# Altium schematic sheet mojo_cnc_shield.schdoc
size 491 x 209 mm
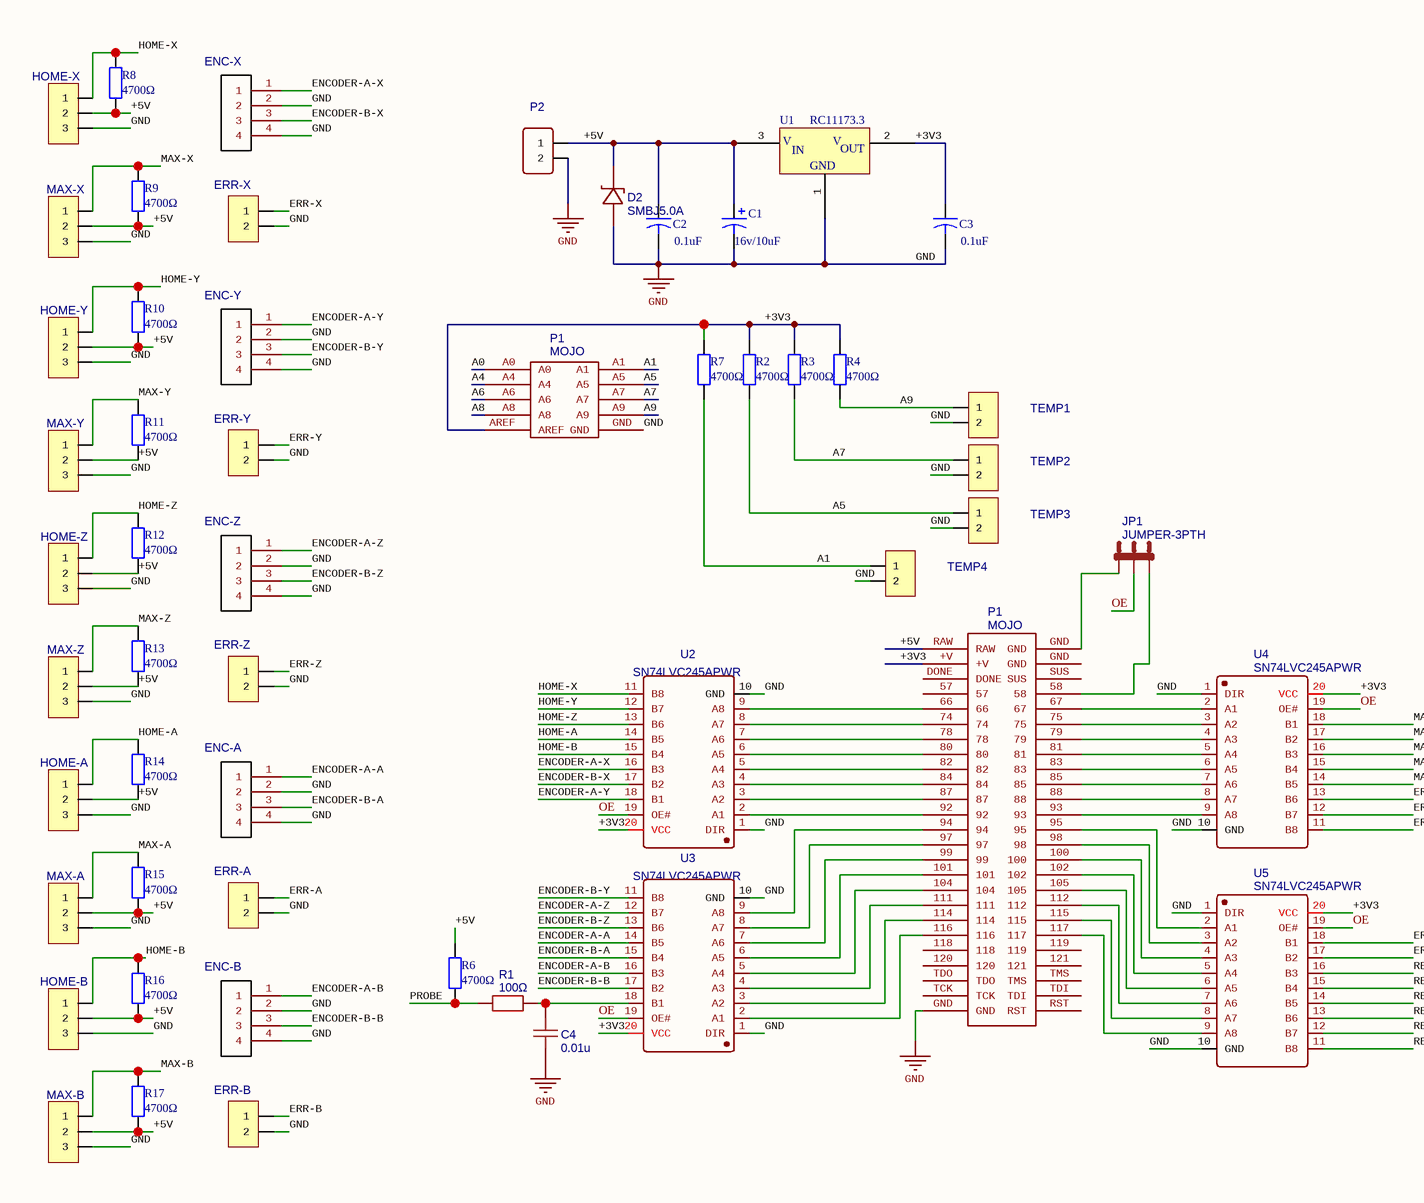
[diagram p0: mojo_cnc_shield.schdoc, left]
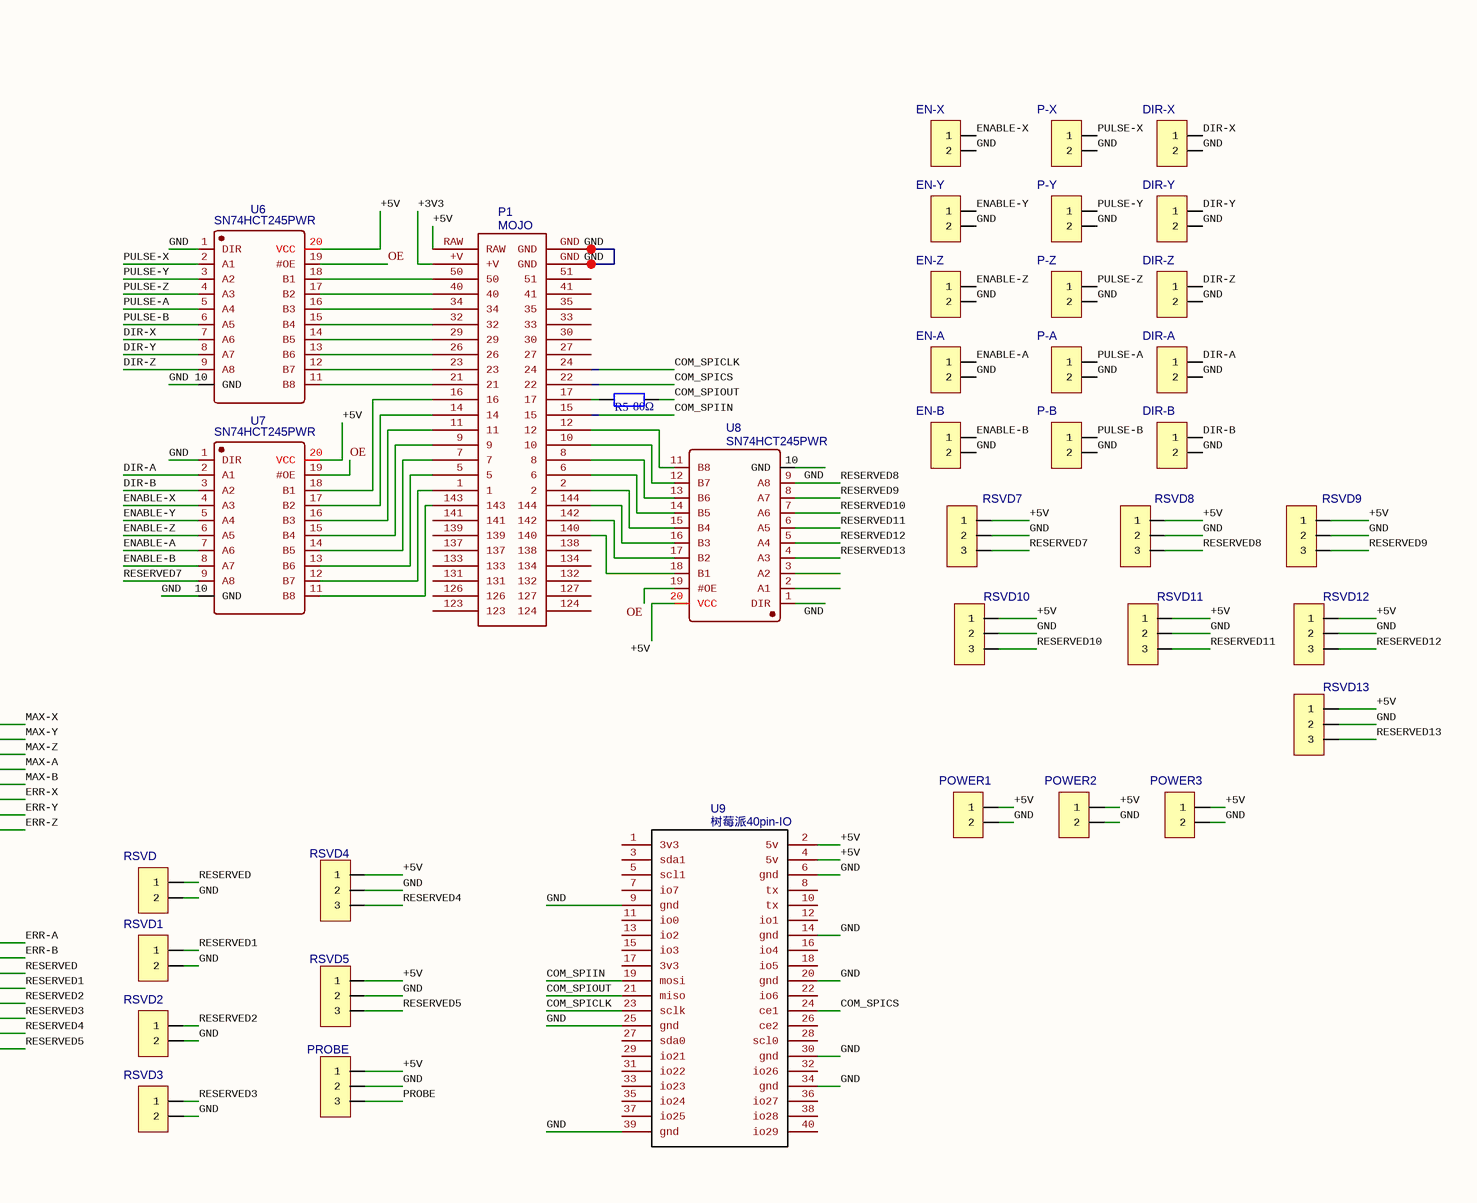
[diagram p1: mojo_cnc_shield.schdoc, right]

## Parts
(Parts that share a designator on the sheet are numbered #1, #2 ... from top to bottom, then left to right.)
C1  16v/10uF  [C1206]
C2  0.1uF  [C0805]
C3  0.1uF  [C0805]
C4  0.01u  [C0805]
D2  SMBJ5.0A  [SMB_L4.6-W3.6-LS5.3-R-RD]
DIR-A  5264-2P  [HDR-M-2.54_1X2]  (value not drawn)
DIR-B  5264-2P  [HDR-M-2.54_1X2]  (value not drawn)
DIR-X  5264-2P  [HDR-M-2.54_1X2]  (value not drawn)
DIR-Y  5264-2P  [HDR-M-2.54_1X2]  (value not drawn)
DIR-Z  5264-2P  [HDR-M-2.54_1X2]  (value not drawn)
EN-A  5264-2P  [HDR-M-2.54_1X2]  (value not drawn)
EN-B  5264-2P  [HDR-M-2.54_1X2]  (value not drawn)
EN-X  5264-2P  [HDR-M-2.54_1X2]  (value not drawn)
EN-Y  5264-2P  [HDR-M-2.54_1X2]  (value not drawn)
EN-Z  5264-2P  [HDR-M-2.54_1X2]  (value not drawn)
ENC-A  5264-04A  [HDR-M-2.54_1X4]  (value not drawn)
ENC-B  5264-04A  [HDR-M-2.54_1X4]  (value not drawn)
ENC-X  5264-04A  [HDR-M-2.54_1X4]  (value not drawn)
ENC-Y  5264-04A  [HDR-M-2.54_1X4]  (value not drawn)
ENC-Z  5264-04A  [HDR-M-2.54_1X4]  (value not drawn)
ERR-A  5264-2P  [HDR-M-2.54_1X2]  (value not drawn)
ERR-B  5264-2P  [HDR-M-2.54_1X2]  (value not drawn)
ERR-X  5264-2P  [HDR-M-2.54_1X2]  (value not drawn)
ERR-Y  5264-2P  [HDR-M-2.54_1X2]  (value not drawn)
ERR-Z  5264-2P  [HDR-M-2.54_1X2]  (value not drawn)
HOME-A  5264-3P  [HDR-M-2.54_1X3]  (value not drawn)
HOME-B  5264-3P  [HDR-M-2.54_1X3]  (value not drawn)
HOME-X  5264-3P  [HDR-M-2.54_1X3]  (value not drawn)
HOME-Y  5264-3P  [HDR-M-2.54_1X3]  (value not drawn)
HOME-Z  5264-3P  [HDR-M-2.54_1X3]  (value not drawn)
JP1  JUMPER-3PTH  [1X03]
MAX-A  5264-3P  [HDR-M-2.54_1X3]  (value not drawn)
MAX-B  5264-3P  [HDR-M-2.54_1X3]  (value not drawn)
MAX-X  5264-3P  [HDR-M-2.54_1X3]  (value not drawn)
MAX-Y  5264-3P  [HDR-M-2.54_1X3]  (value not drawn)
MAX-Z  5264-3P  [HDR-M-2.54_1X3]  (value not drawn)
P1#1  MOJO  [MOJO]
P1#2  MOJO  [MOJO]
P1#3  MOJO  [MOJO]
P2  CONN-TH_2P-P5.08  [CONN-TH_2P-P5.08]  (value not drawn)
P-A  5264-2P  [HDR-M-2.54_1X2]  (value not drawn)
P-B  5264-2P  [HDR-M-2.54_1X2]  (value not drawn)
P-X  5264-2P  [HDR-M-2.54_1X2]  (value not drawn)
P-Y  5264-2P  [HDR-M-2.54_1X2]  (value not drawn)
P-Z  5264-2P  [HDR-M-2.54_1X2]  (value not drawn)
POWER1  5264-2P  [HDR-M-2.54_1X2]  (value not drawn)
POWER2  5264-2P  [HDR-M-2.54_1X2]  (value not drawn)
POWER3  5264-2P  [HDR-M-2.54_1X2]  (value not drawn)
PROBE  5264-3P  [HDR-M-2.54_1X3]  (value not drawn)
R1  100Ω  [R0805]
R2  4700Ω  [R0805]
R3  4700Ω  [R0805]
R4  4700Ω  [R0805]
R5  80Ω  [R0805]
R6  4700Ω  [R0805]
R7  4700Ω  [R0805]
R8  4700Ω  [R0805]
R9  4700Ω  [R0805]
R10  4700Ω  [R0805]
R11  4700Ω  [R0805]
R12  4700Ω  [R0805]
R13  4700Ω  [R0805]
R14  4700Ω  [R0805]
R15  4700Ω  [R0805]
R16  4700Ω  [R0805]
R17  4700Ω  [R0805]
RSVD  5264-2P  [HDR-M-2.54_1X2]  (value not drawn)
RSVD1  5264-2P  [HDR-M-2.54_1X2]  (value not drawn)
RSVD2  5264-2P  [HDR-M-2.54_1X2]  (value not drawn)
RSVD3  5264-2P  [HDR-M-2.54_1X2]  (value not drawn)
RSVD4  5264-3P  [HDR-M-2.54_1X3]  (value not drawn)
RSVD5  5264-3P  [HDR-M-2.54_1X3]  (value not drawn)
RSVD7  5264-3P  [HDR-M-2.54_1X3]  (value not drawn)
RSVD8  5264-3P  [HDR-M-2.54_1X3]  (value not drawn)
RSVD9  5264-3P  [HDR-M-2.54_1X3]  (value not drawn)
RSVD10  5264-3P  [HDR-M-2.54_1X3]  (value not drawn)
RSVD11  5264-3P  [HDR-M-2.54_1X3]  (value not drawn)
RSVD12  5264-3P  [HDR-M-2.54_1X3]  (value not drawn)
RSVD13  5264-3P  [HDR-M-2.54_1X3]  (value not drawn)
TEMP1  5264-2P  [HDR-M-2.54_1X2]  (value not drawn)
TEMP2  5264-2P  [HDR-M-2.54_1X2]  (value not drawn)
TEMP3  5264-2P  [HDR-M-2.54_1X2]  (value not drawn)
TEMP4  5264-2P  [HDR-M-2.54_1X2]  (value not drawn)
U1  RC11173.3  [SOT-223]
U2  SN74LVC245APWR  [TSSOP-20_L6.5-W4.4-P0.65-LS6.4-BL]
U3  SN74LVC245APWR  [TSSOP-20_L6.5-W4.4-P0.65-LS6.4-BL]
U4  SN74LVC245APWR  [TSSOP-20_L6.5-W4.4-P0.65-LS6.4-BL]
U5  SN74LVC245APWR  [TSSOP-20_L6.5-W4.4-P0.65-LS6.4-BL]
U6  SN74HCT245PWR  [TSSOP-20_L6.5-W4.4-P0.65-LS6.4-BL]
U7  SN74HCT245PWR  [TSSOP-20_L6.5-W4.4-P0.65-LS6.4-BL]
U8  SN74HCT245PWR  [TSSOP-20_L6.5-W4.4-P0.65-LS6.4-BL]
U9  树莓派40pin-IO  [树莓派40PIN-IO]

## Nets
GND: C1.2 C2.2 C3.2 C4.2 D2.1(A) DIR-A.2 DIR-B.2 DIR-X.2 DIR-Y.2 DIR-Z.2 EN-A.2 EN-B.2 EN-X.2 EN-Y.2 EN-Z.2 ENC-A.2 ENC-A.4 ENC-B.2 ENC-B.4 ENC-X.2 ENC-X.4 ENC-Y.2 ENC-Y.4 ENC-Z.2 ENC-Z.4 ERR-A.2 ERR-B.2 ERR-X.2 ERR-Y.2 ERR-Z.2 HOME-A.3 HOME-B.3 HOME-X.3 HOME-Y.3 HOME-Z.3 MAX-A.3 MAX-B.3 MAX-X.3 MAX-Y.3 MAX-Z.3 P1#1.GND P1#2.GND P1#3.GND P2.2 P-A.2 P-B.2 P-X.2 P-Y.2 P-Z.2 POWER1.2 POWER2.2 POWER3.2 PROBE.2 RSVD.2 RSVD1.2 RSVD2.2 RSVD3.2 RSVD4.2 RSVD5.2 RSVD7.2 RSVD8.2 RSVD9.2 RSVD10.2 RSVD11.2 RSVD12.2 RSVD13.2 TEMP1.2 TEMP2.2 TEMP3.2 TEMP4.2 U1.1 U2.1(DIR) U2.10(GND) U3.1(DIR) U3.10(GND) U4.1(DIR) U4.10(GND) U5.1(DIR) U5.10(GND) U6.1(DIR) U6.10(GND) U7.1(DIR) U7.10(GND) U8.1(DIR) U8.10(GND) U9.6(gnd) U9.9(gnd) U9.14(gnd) U9.20(gnd) U9.25(gnd) U9.30(gnd) U9.34(gnd) U9.39(gnd)
+3V3: C3.1 P1#1.AREF P1#2.+V P1#3.+V R2.2 R3.2 R4.2 R7.2 U1.2 U2.20(VCC) U3.20(VCC) U4.20(VCC) U5.20(VCC)
+5V: C1.1 C2.1 D2.2(K) HOME-A.2 HOME-B.2 HOME-X.2 HOME-Y.2 HOME-Z.2 MAX-A.2 MAX-B.2 MAX-X.2 MAX-Y.2 MAX-Z.2 P1#2.RAW P1#3.RAW P2.1 POWER1.1 POWER2.1 POWER3.1 PROBE.1 R6.2 R8.1 R9.1 R10.1 R11.1 R12.1 R13.1 R14.1 R15.1 R16.1 R17.1 RSVD4.1 RSVD5.1 RSVD7.1 RSVD8.1 RSVD9.1 RSVD10.1 RSVD11.1 RSVD12.1 RSVD13.1 U1.3 U6.20(VCC) U7.20(VCC) U8.20(VCC) U9.2(5v) U9.4(5v)
A0: P1#1.A0
A1: P1#1.A1 R7.1 TEMP4.1
A4: P1#1.A4
A5: P1#1.A5 R2.1 TEMP3.1
A6: P1#1.A6
A7: P1#1.A7 R3.1 TEMP2.1
A8: P1#1.A8
A9: P1#1.A9 R4.1 TEMP1.1
COM_SPICLK: P1#2.24 U9.23(sclk)
COM_SPICS: P1#2.22 U9.24(ce1)
COM_SPIIN: P1#2.15 U9.19(mosi)
COM_SPIOUT: R5.2 U9.21(miso)
DIR-A: DIR-A.1 U7.2(A1)
DIR-B: DIR-B.1 U7.3(A2)
DIR-X: DIR-X.1 U6.7(A6)
DIR-Y: DIR-Y.1 U6.8(A7)
DIR-Z: DIR-Z.1 U6.9(A8)
ENABLE-A: EN-A.1 U7.7(A6)
ENABLE-B: EN-B.1 U7.8(A7)
ENABLE-X: EN-X.1 U7.4(A3)
ENABLE-Y: EN-Y.1 U7.5(A4)
ENABLE-Z: EN-Z.1 U7.6(A5)
ENCODER-A-A: ENC-A.1 U3.14(B5)
ENCODER-A-B: ENC-B.1 U3.16(B3)
ENCODER-A-X: ENC-X.1 U2.16(B3)
ENCODER-A-Y: ENC-Y.1 U2.18(B1)
ENCODER-A-Z: ENC-Z.1 U3.12(B7)
ENCODER-B-A: ENC-A.3 U3.15(B4)
ENCODER-B-B: ENC-B.3 U3.17(B2)
ENCODER-B-X: ENC-X.3 U2.17(B2)
ENCODER-B-Y: ENC-Y.3 U3.11(B8)
ENCODER-B-Z: ENC-Z.3 U3.13(B6)
ERR-A: ERR-A.1 U5.18(B1)
ERR-B: ERR-B.1 U5.17(B2)
ERR-X: ERR-X.1 U4.13(B6)
ERR-Y: ERR-Y.1 U4.12(B7)
ERR-Z: ERR-Z.1 U4.11(B8)
HOME-A: HOME-A.1 R14.2 U2.14(B5)
HOME-B: HOME-B.1 R16.2 U2.15(B4)
HOME-X: HOME-X.1 R8.2 U2.11(B8)
HOME-Y: HOME-Y.1 R10.2 U2.12(B7)
HOME-Z: HOME-Z.1 R12.2 U2.13(B6)
MAX-A: MAX-A.1 R15.2 U4.15(B4)
MAX-B: MAX-B.1 R17.2 U4.14(B5)
MAX-X: MAX-X.1 R9.2 U4.18(B1)
MAX-Y: MAX-Y.1 R11.2 U4.17(B2)
MAX-Z: MAX-Z.1 R13.2 U4.16(B3)
OE: JP1.2 U2.19(OE#) U3.19(OE#) U4.19(OE#) U5.19(OE#) U6.19(#OE) U7.19(#OE) U8.19(#OE)
PROBE: PROBE.3 R1.1 R6.1
PULSE-A: P-A.1 U6.5(A4)
PULSE-B: P-B.1 U6.6(A5)
PULSE-X: P-X.1 U6.2(A1)
PULSE-Y: P-Y.1 U6.3(A2)
PULSE-Z: P-Z.1 U6.4(A3)
RESERVED: RSVD.1 U5.16(B3)
RESERVED1: RSVD1.1 U5.15(B4)
RESERVED2: RSVD2.1 U5.14(B5)
RESERVED3: RSVD3.1 U5.13(B6)
RESERVED4: RSVD4.3 U5.12(B7)
RESERVED5: RSVD5.3 U5.11(B8)
RESERVED7: RSVD7.3 U7.9(A8)
RESERVED8: RSVD8.3 U8.9(A8)
RESERVED9: RSVD9.3 U8.8(A7)
RESERVED10: RSVD10.3 U8.7(A6)
RESERVED11: RSVD11.3 U8.6(A5)
RESERVED12: RSVD12.3 U8.5(A4)
RESERVED13: RSVD13.3 U8.4(A3)
NetC4_1: C4.1 R1.2 U3.18(B1)
NetJP1_1: JP1.1 P1#3.GND
NetJP1_3: JP1.3 P1#3.58
NetP1#2_1: P1#2.1 U7.12(B7)
NetP1#2_2: P1#2.2 U8.15(B4)
NetP1#2_5: P1#2.5 U7.13(B6)
NetP1#2_6: P1#2.6 U8.14(B5)
NetP1#2_7: P1#2.7 U7.14(B5)
NetP1#2_8: P1#2.8 U8.13(B6)
NetP1#2_9: P1#2.9 U7.15(B4)
NetP1#2_10: P1#2.10 U8.12(B7)
NetP1#2_11: P1#2.11 U7.16(B3)
NetP1#2_12: P1#2.12 U8.11(B8)
NetP1#2_14: P1#2.14 U7.17(B2)
NetP1#2_16: P1#2.16 U7.18(B1)
NetP1#2_17: P1#2.17 R5.1
NetP1#2_21: P1#2.21 U6.11(B8)
NetP1#2_23: P1#2.23 U6.12(B7)
NetP1#2_26: P1#2.26 U6.13(B6)
NetP1#2_29: P1#2.29 U6.14(B5)
NetP1#2_32: P1#2.32 U6.15(B4)
NetP1#2_34: P1#2.34 U6.16(B3)
NetP1#2_40: P1#2.40 U6.17(B2)
NetP1#2_50: P1#2.50 U6.18(B1)
NetP1#2_140: P1#2.140 U8.18(B1)
NetP1#2_142: P1#2.142 U8.17(B2)
NetP1#2_143: P1#2.143 U7.11(B8)
NetP1#2_144: P1#2.144 U8.16(B3)
NetP1#3_66: P1#3.66 U2.9(A8)
NetP1#3_67: P1#3.67 U4.2(A1)
NetP1#3_74: P1#3.74 U2.8(A7)
NetP1#3_75: P1#3.75 U4.3(A2)
NetP1#3_78: P1#3.78 U2.7(A6)
NetP1#3_79: P1#3.79 U4.4(A3)
NetP1#3_80: P1#3.80 U2.6(A5)
NetP1#3_81: P1#3.81 U4.5(A4)
NetP1#3_82: P1#3.82 U2.5(A4)
NetP1#3_83: P1#3.83 U4.6(A5)
NetP1#3_84: P1#3.84 U2.4(A3)
NetP1#3_85: P1#3.85 U4.7(A6)
NetP1#3_87: P1#3.87 U2.3(A2)
NetP1#3_88: P1#3.88 U4.8(A7)
NetP1#3_92: P1#3.92 U2.2(A1)
NetP1#3_93: P1#3.93 U4.9(A8)
NetP1#3_94: P1#3.94 U3.9(A8)
NetP1#3_95: P1#3.95 U5.2(A1)
NetP1#3_97: P1#3.97 U3.8(A7)
NetP1#3_98: P1#3.98 U5.3(A2)
NetP1#3_99: P1#3.99 U3.7(A6)
NetP1#3_100: P1#3.100 U5.4(A3)
NetP1#3_101: P1#3.101 U3.6(A5)
NetP1#3_102: P1#3.102 U5.5(A4)
NetP1#3_104: P1#3.104 U3.5(A4)
NetP1#3_105: P1#3.105 U5.6(A5)
NetP1#3_111: P1#3.111 U3.4(A3)
NetP1#3_112: P1#3.112 U5.7(A6)
NetP1#3_114: P1#3.114 U3.3(A2)
NetP1#3_115: P1#3.115 U5.8(A7)
NetP1#3_116: P1#3.116 U3.2(A1)
NetP1#3_117: P1#3.117 U5.9(A8)

Not connected (* = marked no-connect by the designer): P1#2 27 30 33 35 41 51 123 124 126 127 131 132 133 134 137 138 139 141; P1#3 57 118 119 120 121 DONE RST SUS TCK TDI TDO TMS; U8 2(A1) 3(A2); U9 1(3v3) 3(sda1) 5(scl1) 7(io7) 8(tx) 10(tx) 11(io0) 12(io1) 13(io2) 15(io3) 16(io4) 17(3v3) 18(io5) 22(io6) 26(ce2) 27(sda0) 28(scl0) 29(io21) 31(io22) 32(io26) 33(io23) 35(io24) 36(io27) 37(io25) 38(io28) 40(io29)

## Notes on the sheet
- (in symbol RC11173.3) V; IN; OUT; GND

## Library data of the parts
C4 = 0.01u: nameAlias: Value(F); Contributor: LCEDA_Lib; spicePre: C; spiceSymbolName: C_0805_US
D2 = SMBJ5.0A: BOM_Manufacturer: Brightking; BOM_Paste Type: expand; BOM_Assembly Type: smtWeld; BOM_Supplier: LCSC; BOM_Manufacturer Part: SMBJ5.0A; image: //image.lceda.cn/szlcsc/C78423.jpg; BOM_Supplier Part: C78423; spicePre: D; spiceSymbolName: SMBJ5.0A
DIR-A DIR-B DIR-X DIR-Y DIR-Z EN-A EN-B EN-X EN-Y EN-Z ERR-A ERR-B ERR-X ERR-Y ERR-Z P-A P-B P-X P-Y P-Z POWER1-POWER3 RSVD RSVD1-RSVD3 TEMP1-TEMP4 = 5264-2P: Contributor: Cherry_King; spicePre: J; spiceSymbolName: 5264-2P
ENC-A ENC-B ENC-X ENC-Y ENC-Z = 5264-04A: BOM_Manufacturer: BOOMELE; BOM_Supplier: LCSC; BOM_Manufacturer Part: 5264-04A; image: //image.lceda.cn/szlcsc/C40159.jpg; BOM_Supplier Part: C40159; spicePre: P; spiceSymbolName: 5264-04A
HOME-A HOME-B HOME-X HOME-Y HOME-Z MAX-A MAX-B MAX-X MAX-Y MAX-Z PROBE RSVD4 RSVD5 RSVD7-RSVD13 = 5264-3P: Contributor: Cherry_King; spicePre: J; spiceSymbolName: 5264-3P
JP1 = JUMPER-3PTH: Contributor: SparkFun; spicePre: J; spiceSymbolName: JUMPER-3PTH
P1#1-P1#3 = MOJO: subpart_no: 2; Contributor: feversky; spicePre: P; spiceSymbolName: MOJO
P2 = CONN-TH_2P-P5.08: Contributor: LCEDA_Lib; BOM_Supplier: LCSC; spicePre: P; spiceSymbolName: CONN-TH_2P-P5.08
R1 = 100Ω: nameAlias: Value(Ω); Contributor: LCEDA_Lib; spicePre: R; spiceSymbolName: R_0805_EU
U2-U5 = SN74LVC245APWR: BOM_Manufacturer: TI; SMT Type: Extend; spicePre: X; BOM_Supplier: LCSC; BOM_Manufacturer Part: SN74LVC245APWR; image: //image.lceda.cn/szlcsc/C7848.jpg; BOM_Supplier Part: C7848; BOM_LCSC Assembly: Yes; spiceSymbolName: SN74LVC245APWR
U6-U8 = SN74HCT245PWR: BOM_Manufacturer: TI; SMT Type: Extend; spicePre: X; BOM_Supplier: LCSC; BOM_Manufacturer Part: SN74HCT245PWR; BOM_Supplier Part: C6779; BOM_LCSC Assembly: Yes; spiceSymbolName: SN74HCT245PWR
U9 = 树莓派40pin-IO: Contributor: ragneccc; spicePre: U; spiceSymbolName: 树莓派40pin-IO
C1 = 16v/10uF: Published: 8-Jun-2000; LatestRevisionDate: 17-Jul-2002; LatestRevisionNote: Re-released for DXP Platform.; PackageReference: RB7.6-15; Publisher: Altium Limited
C2 C3 = 0.1uF: Published: 23-Sep-2002; PackageReference: CAPR5-4X5; Publisher: Altium Limited
R2-R4 R6-R17 = 4700Ω: ComponentLink1Description: 供应商链接; ComponentLink1URL: http://www.szlcsc.com/product/details_18398.html; Supplier: LC; SuppliersPartNumber: C17710
R5 = 80Ω: ComponentLink1Description: 供应商链接; ComponentLink1URL: http://www.szlcsc.com/product/details_18398.html; Supplier: LC; SuppliersPartNumber: C17710